# Altium schematic sheet ESP8266.SchDoc
size A3; Date: *******; ApprovedBy: *******; CheckedBy: None; Author: *******; CompanyName: *******; DrawnBy: V.HIEU; Engineer: *******; Organization: *******; Address2: *******; Address3: *******; Address4: *******; DocumentNumber: Doc Num; Revision: V1.0; Email: truongvanhieu17102005@gmail.com; SheetNumber: 9; SheetTotal: 9; CurrentTime: *******; CurrentDate: *******; Time: *******; DocumentFullPathAndName: *******; DocumentName: *******; ModifiedDate: *******; ImagePath: *******; ProjectName: *******; Application_BuildNumber: *******
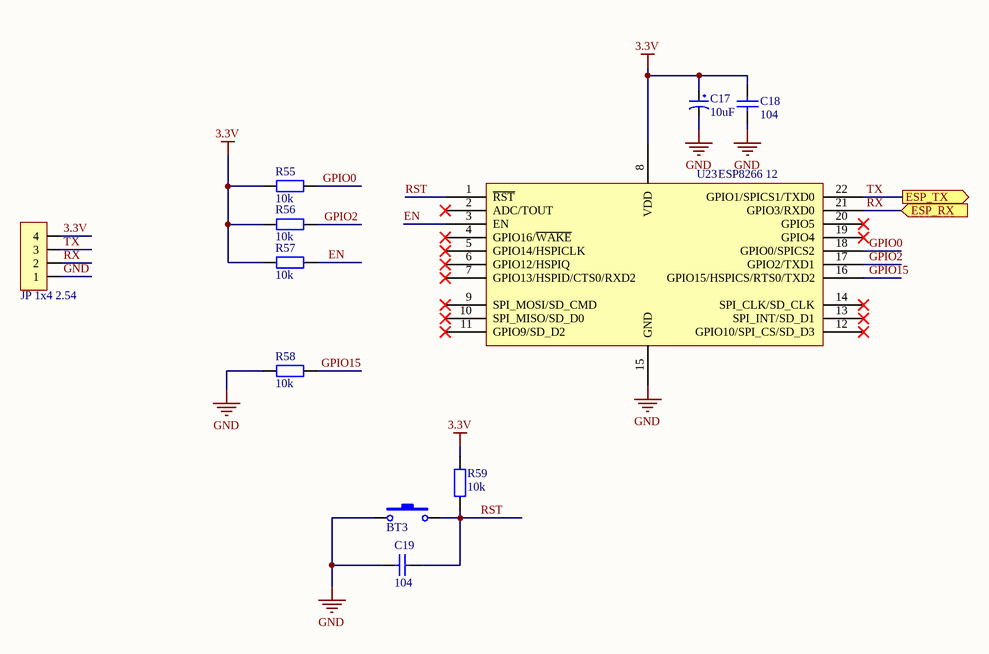
[diagram p0: ESP8266.SchDoc]

## Parts
BT3  Nut Nhan 2 Chan SMD 3x6x2.5  [Nut Nhan 2 Chan SMD 3x6x2.5]  (value not drawn)
C17  10uF  [tu tantalum smd3216]
C18  104  [tu 0603]
C19  104  [tu 0603]
JP2  JP 1x4 2.54  [JP 1x4 DT]
R55  10k  [tro smd 0805]
R56  10k  [tro smd 0805]
R57  10k  [tro smd 0805]
R58  10k  [tro smd 0805]
R59  10k  [tro smd 0805]
U23  ESP8266 12  [ESP8266 12]

## Ports
ESP_RX (in), ESP_TX (out)

## Nets
3.3V: C17.1 C18.1 JP2.4 R55.1 R56.1 R57.1 R59.2 U23.8(VDD)
GND: BT3.1 C17.2 C18.2 C19.1 JP2.1 R58.1 U23.15(GND)
EN: R57.2 U23.3(EN)
GPIO0: R55.2 U23.18(GPIO0/SPICS2)
GPIO2: R56.2 U23.17(GPIO2/TXD1)
GPIO15: R58.2 U23.16(GPIO15/HSPICS/RTS0/TXD2)
RST: BT3.2 C19.2 R59.1 U23.1(~{RST})
RX: JP2.2 U23.21(GPIO3/RXD0) ; port ESP_RX
TX: JP2.3 U23.22(GPIO1/SPICS1/TXD0) ; port ESP_TX

Not connected (* = marked no-connect by the designer): U23 2(ADC/TOUT)* 4(GPIO16/~{WAKE})* 5(GPIO14/HSPICLK)* 6(GPIO12/HSPIQ)* 7(GPIO13/HSPID/CTS0/RXD2)* 9(SPI_MOSI/SD_CMD)* 10(SPI_MISO/SD_D0)* 11(GPIO9/SD_D2)* 12(GPIO10/SPI_CS/SD_D3)* 13(SPI_INT/SD_D1)* 14(SPI_CLK/SD_CLK)* 19(GPIO4)* 20(GPIO5)*

## Notes on the sheet
- Title:
- Size:
- Drawn By:
- Page Contents:
- A3
- Number:
- Checked By:
- Revision:
- Date:
- File:
- License:
- Email:
- Time:
- Sheet
- Website:
- of

## Library data of the parts
BT3 = Nut Nhan 2 Chan SMD 3x6x2.5: Ma_Hang: MH001036; Ten: Nút Nhấn 2 Chân 3x6x2.5MM SMD
C17 = Tu tantalum 10uF 16V SMD3216: Dán; Don_Vi: Con; So_Chan: 2; Ten_Linh_Kien: Tụ tantalum 106C-10uF 16V SMD3216; Ma_Hang: MH001954; Chung_Loai: Dán; Kieu_Chan: *
C18 C19 = Tu 0603 104 50V 10%: Dán; Don_Vi: Con; So_Chan: 2; Ten_Linh_Kien: Tụ 0603 104-100nF 10% 50V; Ma_Hang: MH004568; Chung_Loai: Dán; Kieu_Chan: *
JP2 = JP 1x4 2.54 Duc Thang: Cắm; Ten_Linh_Kien: Jump Đơn Đực 2.54MM 1x40P Thẳng 11MM; Don_Vi: Con; Ma_Hang: MH000903; Ghi_Chu: *; Kieu_Chan: *; Chung_Loai: Cắm
R55-R59 = Tro 0805 5% 10k: Dán; Don_Vi: Con; So_Chan: 2; Ten_Linh_Kien: Trở 0805 5% 10k; Ma_Hang: MH005239; Chung_Loai: Dán; Kieu_Chan: *
U23 = ESP8266 12: ESP8266 12 22 Pin; IC: ESP8266-EX; Vendor: Ai-thinker